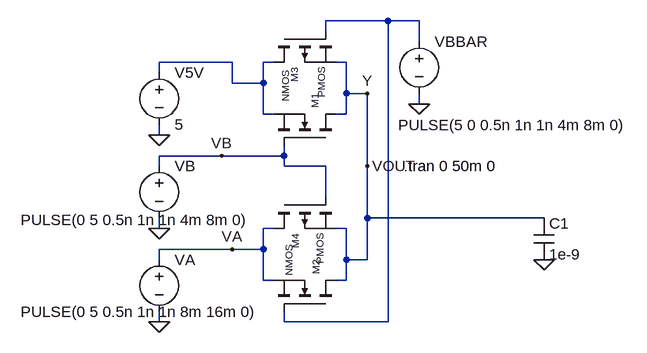
[diagram p0: schematic OR_PassTrans1.asc]
OR_PassTrans1.asc, the LTspice schematic file:
Version 4.1
SHEET 1 892 680
WIRE 448 -16 352 -16
WIRE 496 -16 448 -16
WIRE 352 0 352 -16
WIRE 496 16 496 -16
WIRE 208 48 96 48
WIRE 272 48 256 48
WIRE 384 48 368 48
WIRE 96 64 96 48
WIRE 208 80 208 48
WIRE 256 80 256 48
WIRE 256 80 208 80
WIRE 384 96 384 48
WIRE 416 96 384 96
WIRE 496 112 496 96
WIRE 256 128 256 80
WIRE 272 128 256 128
WIRE 384 128 384 96
WIRE 384 128 368 128
WIRE 96 160 96 144
WIRE 192 192 96 192
WIRE 288 192 288 176
WIRE 288 192 192 192
WIRE 96 208 96 192
WIRE 288 208 288 192
WIRE 352 208 288 208
WIRE 416 208 416 96
WIRE 352 256 352 208
WIRE 416 288 416 208
WIRE 688 288 416 288
WIRE 96 304 96 288
WIRE 272 304 256 304
WIRE 384 304 368 304
WIRE 208 336 96 336
WIRE 256 336 256 304
WIRE 256 336 208 336
WIRE 96 352 96 336
WIRE 384 352 384 304
WIRE 416 352 416 288
WIRE 416 352 384 352
WIRE 256 384 256 336
WIRE 272 384 256 384
WIRE 384 384 384 352
WIRE 384 384 368 384
WIRE 96 448 96 432
WIRE 288 448 288 432
WIRE 448 448 448 -16
WIRE 448 448 288 448
FLAG 96 160 0
FLAG 96 304 0
FLAG 96 448 0
FLAG 496 112 0
FLAG 416 96 Y
FLAG 688 352 0
FLAG 208 336 VA
FLAG 192 192 VB
FLAG 416 208 VOUT
SYMBOL nmos 368 176 M270
WINDOW 0 80 32 Right 1
WINDOW 3 91 67 Top 1
SYMATTR InstName M1
SYMBOL nmos 368 432 M270
WINDOW 0 68 41 Bottom 1
WINDOW 3 79 62 Top 1
SYMATTR InstName M2
SYMBOL pmos 272 0 M90
WINDOW 0 56 32 Left 1
WINDOW 3 79 63 Top 1
SYMATTR InstName M3
SYMBOL pmos 272 256 M90
WINDOW 0 68 23 Top 1
WINDOW 3 79 82 Bottom 1
SYMATTR InstName M4
SYMBOL voltage 96 48 R0
WINDOW 123 0 0 Left 0
WINDOW 39 0 0 Left 0
SYMATTR InstName V5V
SYMATTR Value 5
SYMBOL voltage 96 192 R0
WINDOW 3 -213 99 Left 2
WINDOW 123 0 0 Left 0
WINDOW 39 0 0 Left 0
SYMATTR Value PULSE(0 5 0.5n 1n 1n 4m 8m 0)
SYMATTR InstName VB
SYMBOL voltage 96 336 R0
WINDOW 3 -213 96 Left 2
WINDOW 123 0 0 Left 0
WINDOW 39 0 0 Left 0
SYMATTR Value PULSE(0 5 0.5n 1n 1n 8m 16m 0)
SYMATTR InstName VA
SYMBOL voltage 496 0 R0
WINDOW 3 -32 145 Left 2
WINDOW 123 0 0 Left 0
WINDOW 39 0 0 Left 0
SYMATTR Value PULSE(5 0 0.5n 1n 1n 4m 8m 0)
SYMATTR InstName VBBAR
SYMBOL cap 672 288 R0
SYMATTR InstName C1
SYMATTR Value 1e-9
TEXT 472 208 Left 2 !.tran 0 50m 0

The netlist it stands for:
* OR_PassTrans1.asc
M1 VOUT VB N002 N002 NMOS
M2 VOUT N001 VA VA NMOS
M3 N002 N001 VOUT VOUT PMOS
M4 VA VB VOUT VOUT PMOS
V5V N002 0 5
VB VB 0 PULSE(0 5 0.5n 1n 1n 4m 8m 0)
VA VA 0 PULSE(0 5 0.5n 1n 1n 8m 16m 0)
VBBAR N001 0 PULSE(5 0 0.5n 1n 1n 4m 8m 0)
C1 VOUT 0 1e-9
.model NMOS NMOS
.model PMOS PMOS
.lib standard.mos
.tran 0 50m 0
.backanno
.end